# Altium schematic sheet B293A DAC.SchDoc: DAC
size A4; DocumentNumber: 293; Revision: A
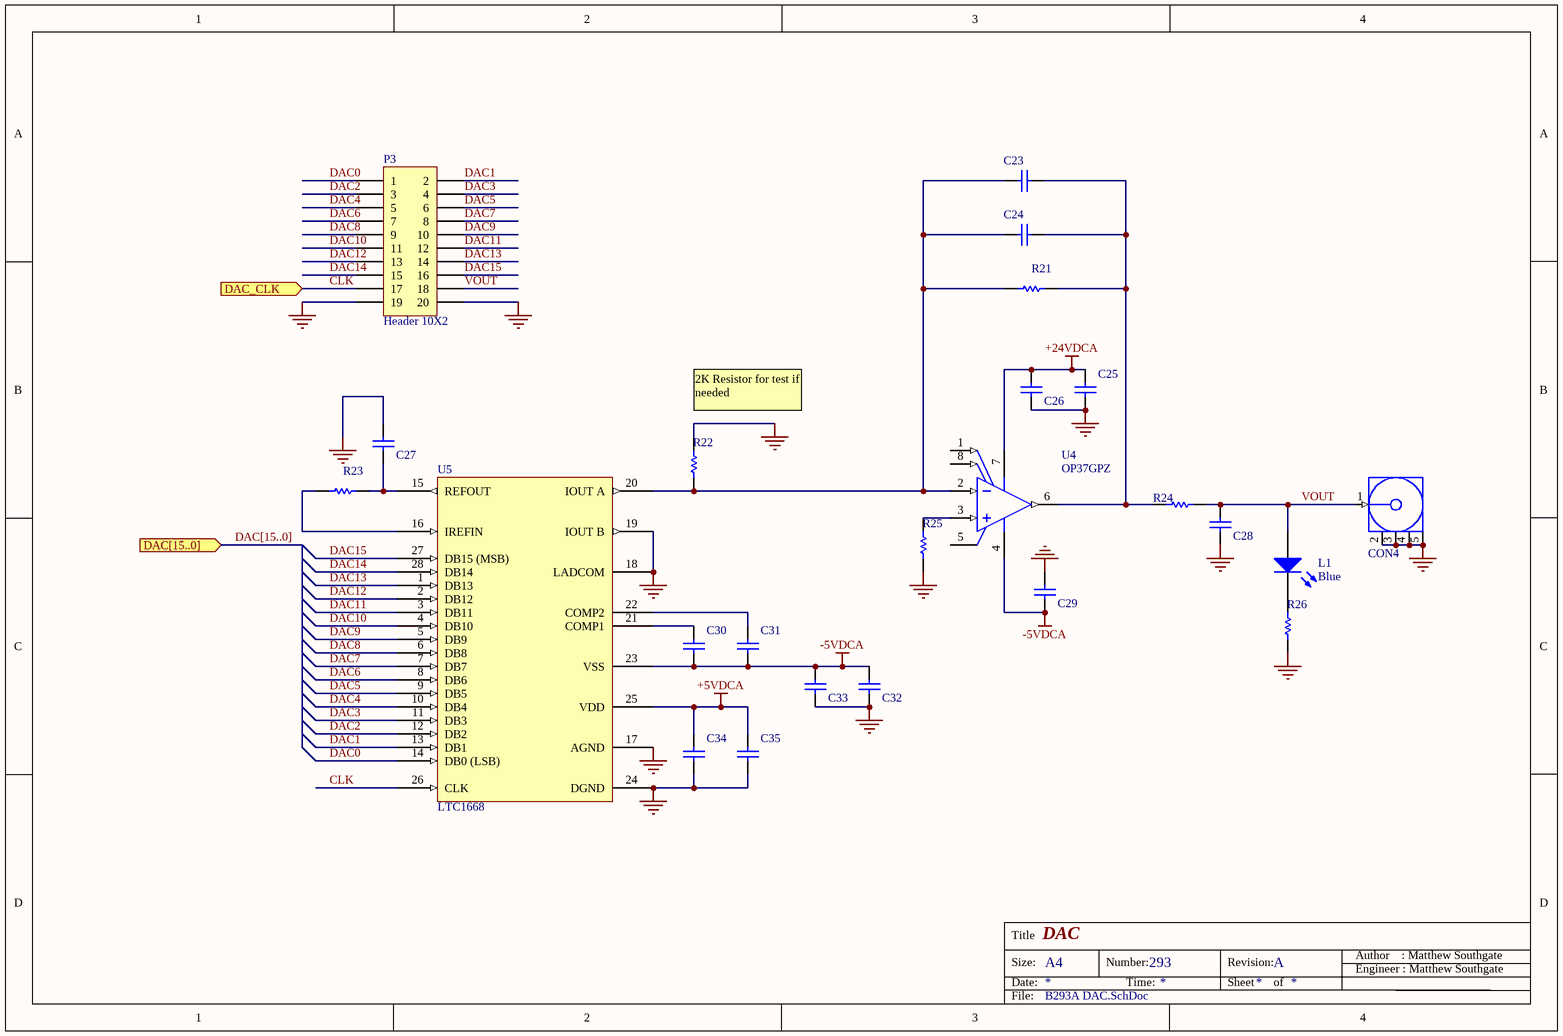
[diagram p0: B293A DAC.SchDoc]

## Parts
C23  CAP 4.7nF 50V 0805(2012)  [CAPC0805(2012)75_M]  (value not drawn)
C24  CAP 470pF 50V 0805(2012)  [CAPC0805(2012)100_M]  (value not drawn)
C25  CAP 10uF 25V 0805(2012)  [CAPC0805(2012)145_N]  (value not drawn)
C26  CAP 100nF 50V 0805(2012)  [CAPC0805(2012)100_M]  (value not drawn)
C27  CAP 100nF 50V 0805(2012)  [CAPC0805(2012)100_M]  (value not drawn)
C28  CAP 100nF 50V 0805(2012)  [CAPC0805(2012)100_M]  (value not drawn)
C29  CAP 100nF 50V 0805(2012)  [CAPC0805(2012)100_M]  (value not drawn)
C30  CAP 100nF 50V 0805(2012)  [CAPC0805(2012)100_M]  (value not drawn)
C31  CAP 100nF 50V 0805(2012)  [CAPC0805(2012)100_M]  (value not drawn)
C32  CAP 10uF 25V 0805(2012)  [CAPC0805(2012)145_N]  (value not drawn)
C33  CAP 100nF 50V 0805(2012)  [CAPC0805(2012)100_M]  (value not drawn)
C34  CAP 100nF 50V 0805(2012)  [CAPC0805(2012)100_M]  (value not drawn)
C35  CAP 10uF 25V 0805(2012)  [CAPC0805(2012)145_N]  (value not drawn)
CON4  SMA Vertical  [SMA Vertical]  (value not drawn)
L1  Blue  [1206 - LED]
P3  Header 10X2  [HDR2X10]
R21  2K2 5% 0805(2012)  [RESC0805(2012)_L]  (value not drawn)
R22  2K2 5% 0805(2012)  [RESC0805(2012)_L]  (value not drawn)
R23  2K2 5% 0805(2012)  [RESC0805(2012)_L]  (value not drawn)
R24  150R 5% 0805(2012)  [RESC0805(2012)_N]  (value not drawn)
R25  2K2 5% 0805(2012)  [RESC0805(2012)_L]  (value not drawn)
R26  6K8 5% 0805(2012)  [RESC0805(2012)_L]  (value not drawn)
U4  OP37GPZ  [ADI-N-8]
U5  LTC1668  [SOP65P800X200-28N]

## Ports
DAC[15..0] (in), DAC_CLK (in)

## Nets
+5VDCA: C34.2 C35.2 U5.25(VDD)
+24VDCA: C25.2 C26.1 U4.7(V+)
-5VDCA: C29.2 C30.1 C31.1 C32.1 C33.2 U4.4(V-) U5.23(VSS)
GND: C25.1 C26.2 C27.1 C28.2 C29.1 C32.2 C33.1 C34.1 C35.1 CON4.2(GND) CON4.3(GND) CON4.4(GND) CON4.5(GND) P3.19 P3.20 R22.2 R25.1 R26.1 U5.17(AGND) U5.18(LADCOM) U5.19(IOUT_B) U5.24(DGND)
CLK: P3.17 U5.26(CLK) ; port DAC_CLK
DAC0: P3.1 U5.14(DB0_(LSB))
DAC1: P3.2 U5.13(DB1)
DAC2: P3.3 U5.12(DB2)
DAC3: P3.4 U5.11(DB3)
DAC4: P3.5 U5.10(DB4)
DAC5: P3.6 U5.9(DB5)
DAC6: P3.7 U5.8(DB6)
DAC7: P3.8 U5.7(DB7)
DAC8: P3.9 U5.6(DB8)
DAC9: P3.10 U5.5(DB9)
DAC10: P3.11 U5.4(DB10)
DAC11: P3.12 U5.3(DB11)
DAC12: P3.13 U5.2(DB12)
DAC13: P3.14 U5.1(DB13)
DAC14: P3.15 U5.28(DB14)
DAC15: P3.16 U5.27(DB15_(MSB))
VOUT: C28.1 CON4.1(Signal) L1.A P3.18 R24.1
NetC23_1: C23.1 C24.1 R21.2 R24.2 U4.6(OUT)
NetC23_2: C23.2 C24.2 R21.1 R22.1 U4.2(-IN) U5.20(IOUT_A)
NetC27_2: C27.2 R23.2 U5.15(REFOUT)
NetC30_2: C30.2 U5.21(COMP1)
NetC31_2: C31.2 U5.22(COMP2)
NetL1_K: L1.K R26.2
NetR23_1: R23.1 U5.16(IREFIN)
NetR25_2: R25.2 U4.3(+IN)

Not connected (* = marked no-connect by the designer): U4 1(VOS_TRIM) 5(NC) 8(VOS_TRIM)

## Buses and harness runs
bus DAC[15..0] = port DAC[15..0]

## Notes on the sheet
- (near R22) 2K Resistor for test if needed
- Title
- Size:
- Date:
- A4
- Number:
- Time:
- Revision:
- Sheet
- of
- Engineer : Matthew Southgate
- Author    : Matthew Southgate
- File:

## Library data of the parts
C23 = CMP-1036-03591-1: CAP 4.7nF 50V ±10% 0805 (2012 Metric) Thickness 0.75mm SMD; Case-Metric: 2012; Case-EIA: 0805; Technology: SMT; Rated Voltage: 50 V; Value: 4.7nF; Tolerance: ±10%; Max Thickness: 0.75 mm
C24 = CMP-1036-02672-1: CAP 470pF 50V ±10% 0805 (2012 Metric) Thickness 1mm SMD; Case-Metric: 2012; Case-EIA: 0805; Rated Voltage: 50 V; Max Thickness: 1 mm; Tolerance: ±10%; Technology: SMT; Value: 470pF
C25 C32 C35 = CMP-1036-04933-1: CAP 10uF 25V ±20% 0805 (2012 Metric) Thickness 1.45mm SMD; Case-EIA: 0805; Case-Metric: 2012; Technology: SMT; Tolerance: ±20%; Max Thickness: 1.45 mm; Value: 10uF; Rated Voltage: 25 V
C26-C31 C33 C34 = CMP-1036-04423-1: CAP 100nF 50V ±20% 0805 (2012 Metric) Thickness 1mm SMD; Case-Metric: 2012; Case-EIA: 0805; Value: 100nF; Max Thickness: 1 mm; Rated Voltage: 50 V; Tolerance: ±20%; Technology: SMT
CON4 = SMA Vertical: Manufacturers Part No: 5-1814832-1; Order Code: 1248990; Supplier: Onecall
L1 = LED 1206 BLUE: LED, 1206, BLUE, 140MCD, 473NM; Manufacturer Part Number: 598-8291-107F; Manufacturer: DIALIGHT; Order Code: 2113953; Supplier: Farnell; Supplier 1: Farnell; RoHS: YES; Stock 1: 239; Pricing 1: 10=0.176, 100=0.169, 250=0.163, 500=0.161, 1000=0.159, 3000=0.102, 3000=0.0999, 30000=0.0979 (GBP); ComponentLink1URL: http://www.farnell.com/datasheets/1484480.pdf; ComponentLink1Description: http://www.farnell.com/datasheets/1484480.pdf; Supplier Part Number 1: 2113953
P3 = Header 10X2: Header, 10-Pin, Dual row; LatestRevisionDate: 17-Jul-2002; LatestRevisionNote: Re-released for DXP Platform.; Publisher: Altium Limited
R21 R23 R25 = CMP-1013-00082-1: 2K2 0.125W 5% 0805 (2012 Metric)  SMD; Value: 2200.00 Ohm; Case-Metric: 2012; Case-EIA: 0805; Technology: SMT; Tolerance: 5 %; Power: 0.125 W
R22 = CMP-1013-00082-1: 2K2 0.125W 5% 0805 (2012 Metric)  SMD; Fitted: No; Value: 2200.00 Ohm; Case-Metric: 2012; Case-EIA: 0805; Technology: SMT; Tolerance: 5 %; Power: 0.125 W
R24 = CMP-1013-00054-1: 150R 0.125W 5% 0805 (2012 Metric)  SMD; Case-EIA: 0805; Case-Metric: 2012; Value: 150.00 Ohm; Tolerance: 5 %; Technology: SMT; Power: 0.125 W
R26 = CMP-1013-00094-1: 6K8 0.125W 5% 0805 (2012 Metric)  SMD; Value: 6800.00 Ohm; Case-EIA: 0805; Case-Metric: 2012; Technology: SMT; Tolerance: 5 %; Power: 0.125 W
U4 = CMP-0384-00210-1: Single Channel Low Noise Operational Amplifier, 63 MHz BW, 17 V/us SR, Industrial, 8-pin DIP (N-8), Tube; Manufacturer: Analog Devices; PackageReference: N-8; ComponentLink1Description: Manufacturer URL; ComponentLink1URL: http://www.analog.com/en/index.html; ComponentLink2URL: http://www.analog.com/static/imported-files/data_sheets/OP37.pdf; ComponentLink3Description: Package Specification; PackageDescription: 8-Pin Plastic Dual In-Line Package, Row spacing 7.62 mm, Pitch 2.54 mm; ComponentLink3URL: http:/www.analog.com/static/imported-files/packages/PKG_PDF/PDIP(N)/N_8.pdf; ComponentLink2Description: Datasheet; DatasheetVersion: Rev. B; PackageVersion: 070606-A; Code_JEDEC: MS-001
U5 = LTC1668: Manufacturer: LINEAR TECHNOLOGY; Manufacturer Part Number: LTC1668CG#PBF; Resolution (Bits): 16; Sampling Rate: 50; Input Channel Type: Parallel; Supply Voltage Range: ± 4.75V to ± 5.25; Digital IC Case Style: SSOP; No. of Pins: 28; A/D / D/A Features: D/A; Base Number: 1668; No. of DACs: 1; Output Type: Differential; SVHC: No SVHC (20-Jun-2013); Settling Time: 20; Supply Current: 33; Supply Voltage Max: 5.25; Supply Voltage Min: 4.75; Supplier 1: Farnell; Supplier Part Number 1: 1609779; RoHS: YES; Stock 1: 5; Pricing 1: 1=21.11, 10=15.83, 100=13.87, 250=13.42, 500=13.04 (GBP); Data Interface: Parallel; Operating Temperature Min: 0; Operating Temperature Max: 70; Packaging: Each; IC Case Style: SSOP; MSL: MSL 1 - Unlimited; No. of Bits: 16; Operating Temperature Range: 0°C to +70; Termination Type: SMD<!--FANDB--><div class="features-and-benefits-container"></div>; ComponentLink1URL: http://www.farnell.com/datasheets/1692371.pdf; ComponentLink1Description: http://www.farnell.com/datasheets/1692371.pdf; ComponentLink2URL: http://www.farnell.com/cad/1542850.zip; ComponentLink2Description: http://www.farnell.com/cad/1542850.zip; Supplier 2: Farnell; Supplier Part Number 2: 1609780; Stock 2: 68; Pricing 2: 1=23.01, 10=16.83, 100=15.73, 250=15.14, 500=14.63 (GBP); ComponentLink3URL: http://www.farnell.com/cad/1542852.zip; ComponentLink3Description: http://www.farnell.com/cad/1542852.zip; Supplier 3: Newark; Supplier Part Number 3: 56M3099; Stock 3: 53; Pricing 3: 1=25.76, 25=20.52, 100=15.9 (USD); ComponentLink4URL: http://www.linear.com/pc/downloadDocument.do?navId=H0,C1,C1155,C1005,C1151,P1850,D1839; ComponentLink4Description: http://www.linear.com/pc/downloadDocument.do?navId=H0,C1,C1155,C1005,C1151,P1850,D1839